# EasyEDA Pro project ProDoc_Schematic1_2024-07-10.epro

# Schematic Schematic1
Create Date: 2024-05-25; Page Name: P1; Project Name: C8T6_PWM; Schematic Name: Schematic1; Update Date: 2024-05-29; Company: 嘉立创EDA; Page Size: A4; Version: V1.0
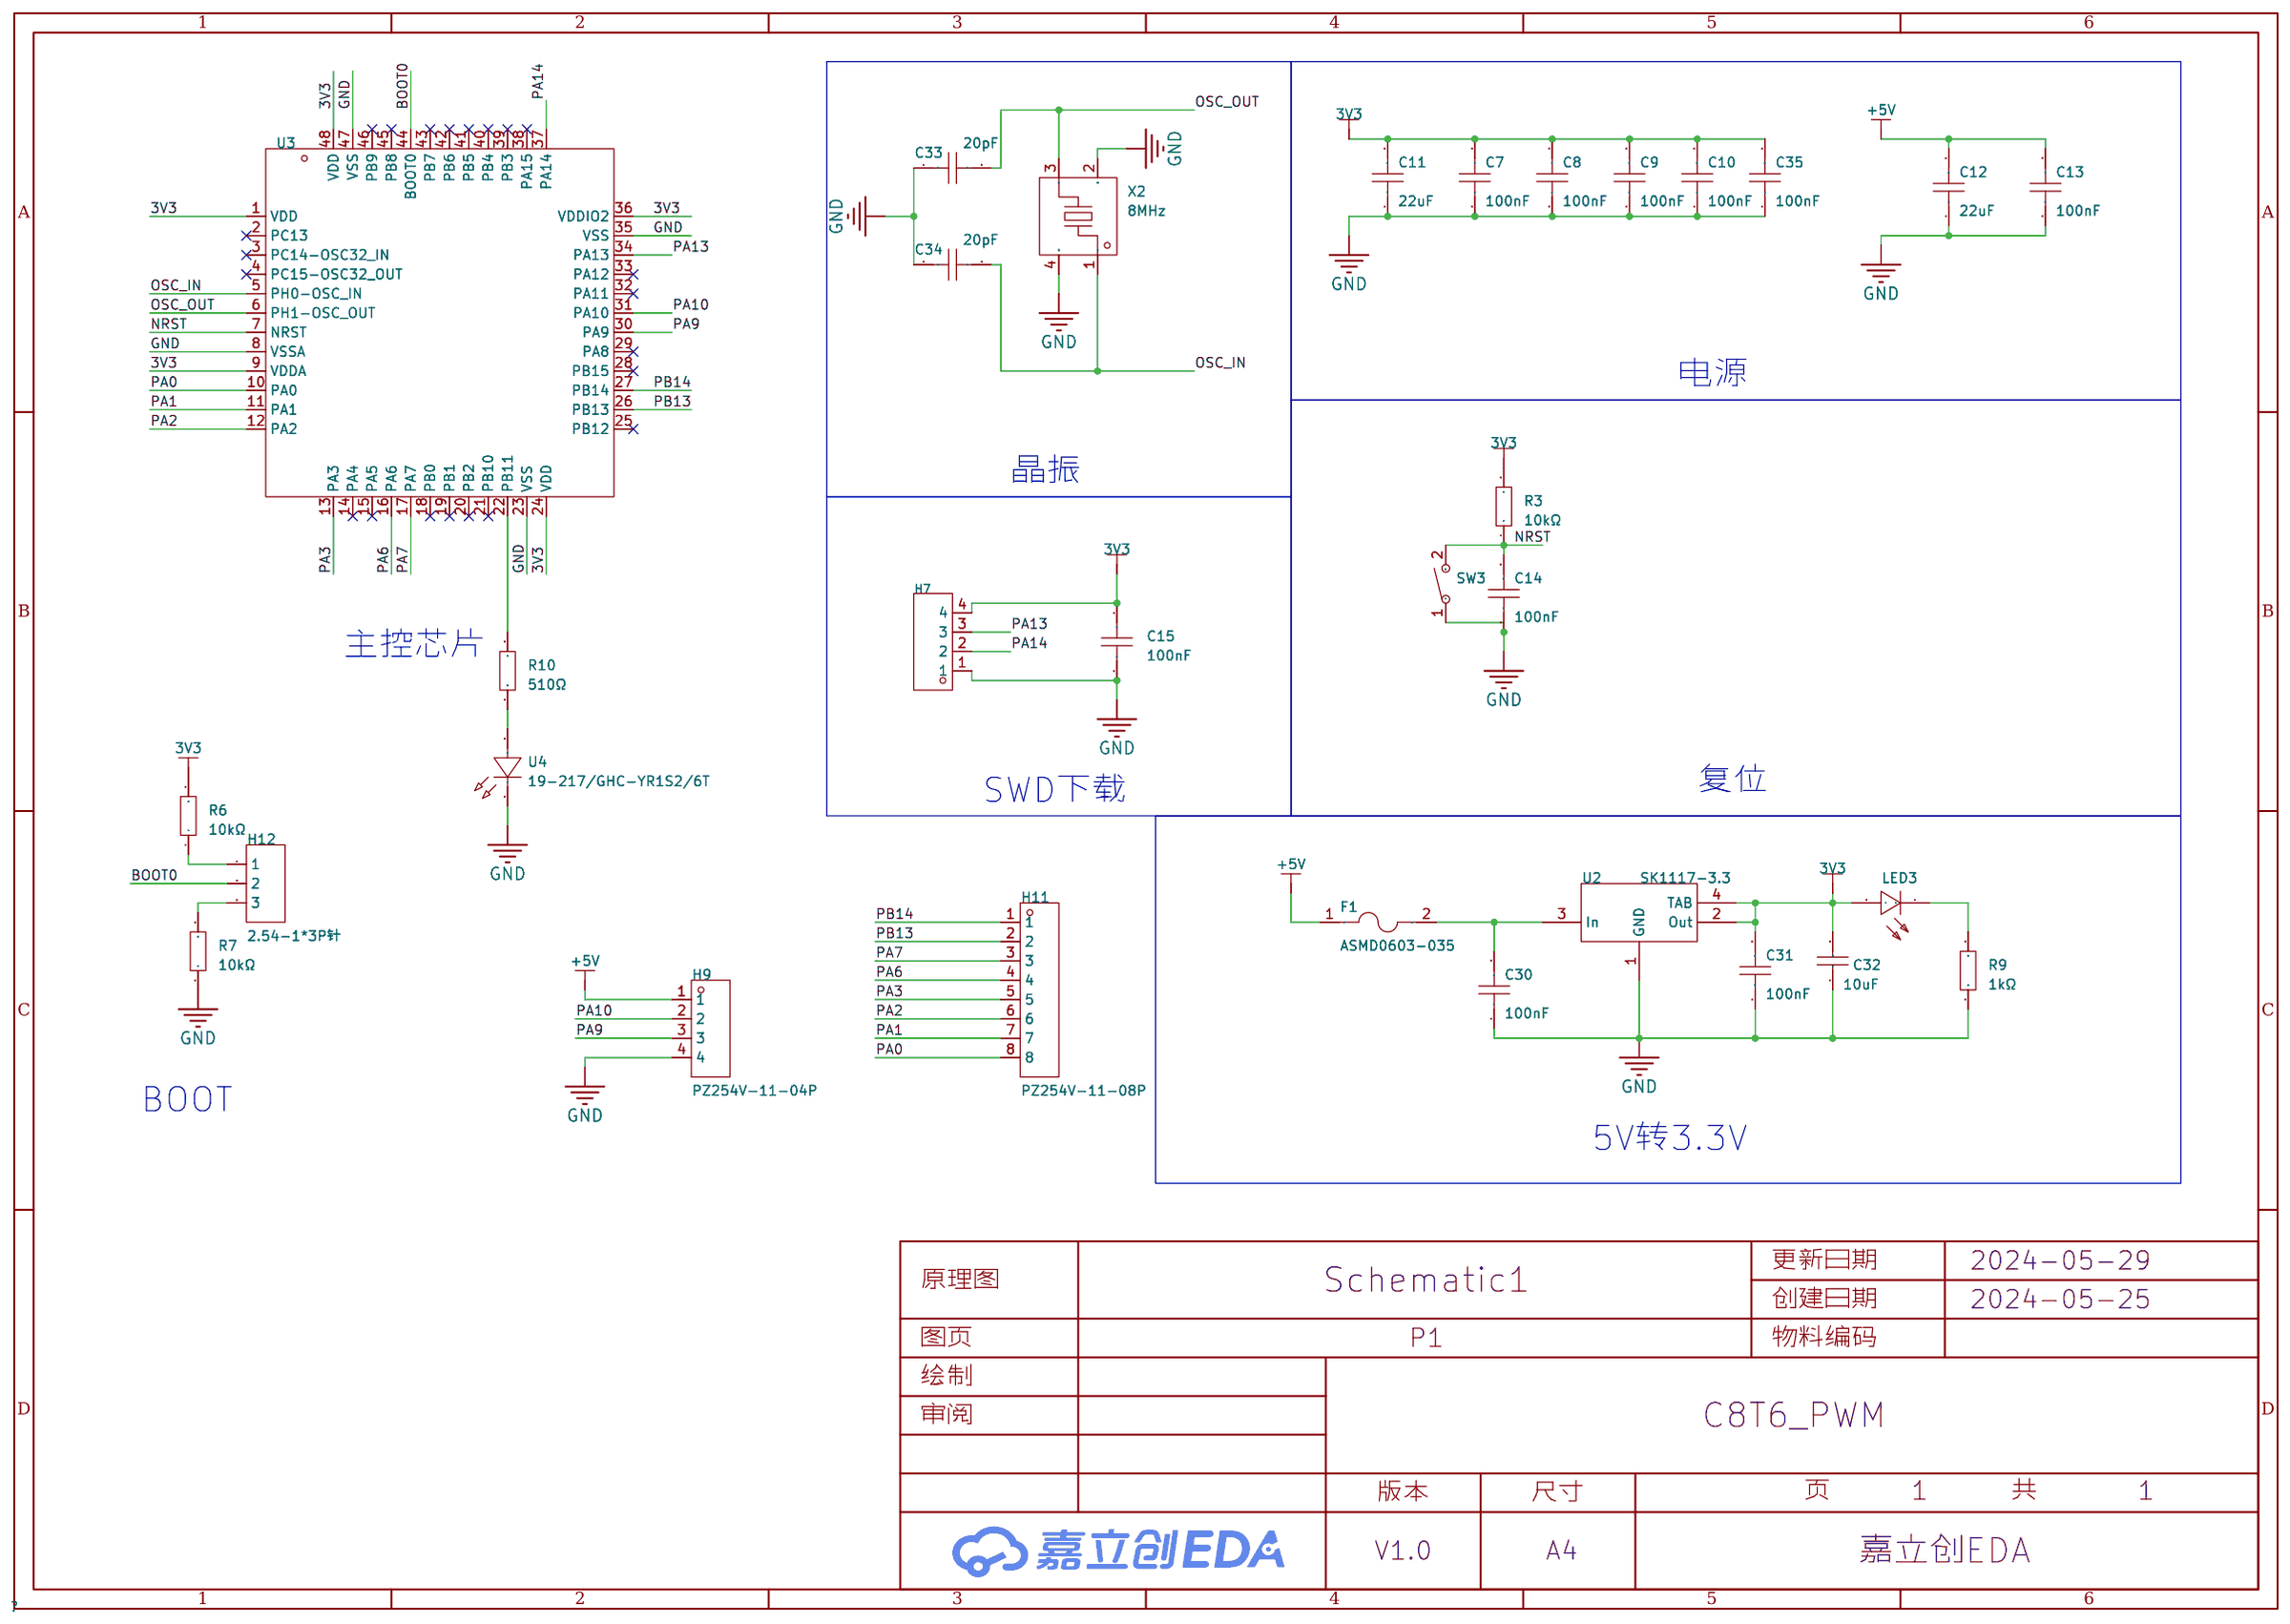
[diagram p0: schematic sheet]

## Parts
C7  100nF  [C0603]
C8  100nF  [C0603]
C9  100nF  [C0603]
C10  100nF  [C0603]
C11  22uF  [C0603]
C12  22uF  [C0603]
C13  100nF  [C0603]
C14  100nF  [C0603]
C15  100nF  [C0603]
C30  100nF  [C0603]
C31  100nF  [C0603]
C32  10uF  [C0805]
C33  20pF  [C0603]
C34  20pF  [C0603]
C35  100nF  [C0603]
F1  ASMD0603-035  [F0603]
H7  2.54-1*4P反弯排针  [HDR-TH_4P-P2.54-H-M-W10.4]
H9  PZ254V-11-04P  [HDR-TH_4P-P2.54-V-M]
H11  PZ254V-11-08P  [HDR-TH_8P-P2.54-V-M]
H12  2.54-1*3P针  [HDR-TH_3P-P2.54-V-M-1]
LED3  NCD0603R1  [LED0603-RD_RED]
R3  10kΩ  [R0805]
R6  10kΩ  [R0603]
R7  10kΩ  [R0603]
R9  1kΩ  [R0805]
R10  510Ω  [R0603]
SW3  UK-B0205G43-DP25Y  [KEY-TH_L6.0-W3.5-P6.50]
U2  SK1117-3.3  [SOT-223_L6.5-W3.5-P2.30-LS7.0-BR]
U3  STM32L051C8T6  [LQFP-48_L7.0-W7.0-P0.50-LS9.0-BL]
U4  19-217/GHC-YR1S2/6T  [LED0603-RD_GREEN]
X2  8MHz  [OSC-SMD_4P-L3.2-W2.5-BL]

## Library data of the parts
C7-C10 C13-C15 C30 C31 C35 = 0603F104Z500CT_C83060: 容值:100nF;精度:-20%~+80%;额定电压:50V;材质(温度系数):Y5V;; LCSC Part Name: 100nF -20%~+80% 50V; Supplier Part: C83060; Manufacturer: Walsin(华新科); Manufacturer Part: 0603F104Z500CT; Supplier Footprint: 0603; JLCPCB Part Class: 扩展库; Datasheet: https://atta.szlcsc.com/upload/public/pdf/source/20161119/1479540179445.pdf; Supplier: LCSC; Tolerance: -20%~+80%; Voltage Rated: 50V; Temperature Coefficient: Y5V
C11 C12 = CL10A226MR8NQNC: 容值:22uF;精度:±20%;额定电压:4V;材质(温度系数):X5R;; LCSC Part Name: 22uF ±20% 4V; Supplier Part: C478860; Manufacturer: SAMSUNG(三星); Supplier Footprint: 0603; JLCPCB Part Class: 扩展库; Datasheet: https://atta.szlcsc.com/upload/public/pdf/source/20200102/C478860_118E1D8359E9872D4918B647A961198D.pdf; Supplier: LCSC; Tolerance: ±20%; Voltage Rated: 4V; Temperature Coefficient: X5R
C32 = CL21A106KAYNNNE_C15850: 容值:10uF;精度:±10%;额定电压:25V;材质(温度系数):X5R;; LCSC Part Name: 10uF ±10% 25V; Supplier Part: C15850; Manufacturer: SAMSUNG(三星); Manufacturer Part: CL21A106KAYNNNE; Supplier Footprint: 0805; JLCPCB Part Class: Basic Part; Datasheet: https://atta.szlcsc.com/upload/public/pdf/source/20160103/1457707679302.pdf; Supplier: LCSC; Tolerance: ±10%; Voltage Rated: 25V; Temperature Coefficient: X5R
C33 C34 = 0603CG200J500NT: 容值:20pF;精度:±5%;额定电压:50V;材质(温度系数):C0G;; LCSC Part Name: 20pF ±5% 50V; Supplier Part: C91702; Manufacturer: FH(风华); Supplier Footprint: 0603; JLCPCB Part Class: 扩展库; Datasheet: https://atta.szlcsc.com/upload/public/pdf/source/20200305/C486355_26A10D38EF8C2A5C37091D0039909270.pdf; Supplier: LCSC; Tolerance: ±5%; Voltage Rated: 50V; Temperature Coefficient: C0G
F1 = ASMD0603-035: 最大电压:6V;最大电流:40A;保持电流:350mA;跳闸电流:750mA;; LCSC Part Name: 6V 350mA 0603自恢复; Supplier Part: C135322; Manufacturer: JDTfuse(集电通); Supplier Footprint: 0603; JLCPCB Part Class: 扩展库; Supplier: LCSC; Operating Voltage (Max): 6V; Current Rating (Max): 40A; Hold Current: 350mA; Trip Current: 750mA; Power Dissipation: 500mW; Resistance - Initial (Ri) (Min): 500mΩ; Resistance - Post Trip (R1) (Max): 3Ω; Maximum Time to Trip: 80ms; Operating Temperature: -40℃~+85℃
H7 = 2.54-1*4P反弯排针: 排数:单排;总PIN位数:4P;间距:2.54mm;插针结构:1x4P;行距:-;安装类型:弯插;圆针/方针:方针;额定电流:3A;额定电压:-;配合针长度:6mm;塑高:-;端接针长度:-;触头材质:-;触头镀层:-;工作温度范围:-55℃~+105℃;颜色:黑色;; LCSC Part Name: 2.54mm 1x4P 弯插 方针 托盘; Supplier Part: C91552; Manufacturer: BOOMELE(博穆精密); Supplier Footprint: 弯插,P=2.54mm; JLCPCB Part Class: 扩展库; Datasheet: https://atta.szlcsc.com/upload/public/pdf/source/20190508/C74252_03DDEC4696EE17172E44B96636392962.pdf; Supplier: LCSC; Number of Rows: 单排; Number of Pins: 4P; Pitch: 2.54mm; Pin Structure: 1x4P; Mounting Type: 弯插; Circluar Pins/Square Pins: 方针; Current Rating (Max): 3A; Length of Mating Pin: 6mm; Operating Temperature Range: -55℃~+105℃; Color: 黑色
H9 = PZ254V-11-04P: 插针结构:1x4P;间距:2.54mm;行距:-;圆针/方针:方针;安装类型:直插;排数:单排;总PIN位数:4P;额定电流:3A;额定电压:250V;配合针长度:6mm;塑高:2.5mm;端接针长度:3mm;触头材质:-;工作温度范围:-40℃~+105℃;颜色:黑色;; LCSC Part Name: 间距:2.54mm 1x4P 直插 方针; Supplier Part: C2691448; Manufacturer: XFCN(兴飞); Supplier Footprint: 插件,P=2.54mm; JLCPCB Part Class: 扩展库; Datasheet: https://atta.szlcsc.com/upload/public/pdf/source/20200309/C492403_F9F19131791D08044AD4F84F8E751A34.pdf; Supplier: LCSC; Pin Structure: 1x4P; Pitch: 2.54mm; Circluar Pins/Square Pins: 方针; Mounting Type: 直插; Number of Rows: 单排; Number of Pins: 4P; Current Rating (Max): 3A; Voltage Rating (Max): 250V; Length of Mating Pin: 6mm; Insulation Height: 2.5mm; Length of End Connection Pin: 3mm; Operating Temperature Range: -40℃~+105℃; Color: 黑色
H11 = PZ254V-11-08P: 插针结构:1x8P;间距:2.54mm;行距:-;圆针/方针:方针;安装类型:直插;排数:单排;总PIN位数:8P;额定电流:-;额定电压:-;配合针长度:6mm;塑高:2.5mm;端接针长度:3mm;触头材质:黄铜;触头镀层:-;工作温度范围:-40℃~+105℃;颜色:黑色;; LCSC Part Name: 间距:2.54mm 1x8P 直插 方针; Supplier Part: C492407; Manufacturer: XFCN(兴飞); Supplier Footprint: 插件,P=2.54mm; JLCPCB Part Class: 扩展库; Datasheet: https://atta.szlcsc.com/upload/public/pdf/source/20200309/C492407_83A6FB26A2233368EDB9516968EC6149.pdf; Supplier: LCSC; Pin Structure: 1x8P; Pitch: 2.54mm; Circluar Pins/Square Pins: 方针; Mounting Type: 直插; Number of Rows: 单排; Number of Pins: 8P; Length of Mating Pin: 6mm; Insulation Height: 2.5mm; Length of End Connection Pin: 3mm; Contact Material: 黄铜; Operating Temperature Range: -40℃~+105℃; Color: 黑色
H12 = 2.54-1*3P针: 插针结构:1x3P;间距:2.54mm;行距:-;圆针/方针:方针;安装类型:直插;排数:单排;总PIN位数:3P;额定电流:3A;额定电压:-;配合针长度:-;塑高:-;端接针长度:-;触头材质:-;触头镀层:-;工作温度范围:-40℃~+105℃;颜色:黑色;; LCSC Part Name: 间距:2.54mm 1x3P 直插 方针; Supplier Part: C49257; Manufacturer: BOOMELE(博穆精密); Supplier Footprint: 插件,P=2.54mm; JLCPCB Part Class: 扩展库; Datasheet: https://atta.szlcsc.com/upload/public/pdf/source/20221018/3E9408392E35E6F57A28985E5F7BF5C9.pdf; Supplier: LCSC; Pin Structure: 1x3P; Pitch: 2.54mm; Circluar Pins/Square Pins: 方针; Mounting Type: 直插; Number of Rows: 单排; Number of Pins: 3P; Current Rating (Max): 3A; Operating Temperature Range: -40℃~+105℃; Color: 黑色
LED3 = NCD0603R1_C84263: 发光颜色:红灯;; LCSC Part Name: 红灯; Supplier Part: C84263; Manufacturer: 国星光电; Supplier Footprint: 0603; JLCPCB Part Class: 扩展库; Datasheet: https://atta.szlcsc.com/upload/public/pdf/source/20200820/C84263_DABC6A75E58F576973B407FDBA283D60.pdf; Supplier: LCSC; Emitted Color: 红灯
R3 = 0805W8F1002T5E_C17414: 电阻类型:厚膜电阻;阻值:10kΩ;精度:±1%;功率:125mW;; LCSC Part Name: 10kΩ ±1% 125mW; Supplier Part: C17414; Manufacturer: UNI-ROYAL(厚声); Manufacturer Part: 0805W8F1002T5E; Supplier Footprint: 0805; JLCPCB Part Class: 基础库; Datasheet: https://atta.szlcsc.com/upload/public/pdf/source/20200306/C422600_1E6D84923E4A46A82E41ADD87F860B5C.pdf; Supplier: LCSC; Type: 厚膜电阻; Tolerance: ±1%; Power(Watts): 125mW; Temperature Coefficient: ±100ppm/℃; Overload Voltage (Max): 150V; Operating Temperature Range: -55℃~+155℃
R6 R7 = 0603WAF1002T5E: 电阻类型:厚膜电阻;阻值:10kΩ;精度:±1%;功率:100mW;最大工作电压:75V;温度系数:±100ppm/℃;; LCSC Part Name: 厚膜电阻 10kΩ ±1% 100mW; Supplier Part: C25804; Manufacturer: UNI-ROYAL(厚声); Supplier Footprint: 0603; JLCPCB Part Class: 基础库; Datasheet: https://atta.szlcsc.com/upload/public/pdf/source/20200306/C422600_1E6D84923E4A46A82E41ADD87F860B5C.pdf; Supplier: LCSC; Type: 厚膜电阻; Tolerance: ±1%; Power(Watts): 100mW; Overload Voltage (Max): 75V; Temperature Coefficient: ±100ppm/℃; Operating Temperature Range: -55℃~+155℃
R9 = 0805W8F1001T5E: 电阻类型:厚膜电阻;阻值:1kΩ;精度:±1%;功率:125mW;; LCSC Part Name: 1kΩ ±1% 125mW; Supplier Part: C17513; Manufacturer: UNI-ROYAL(厚声); Supplier Footprint: 0805; JLCPCB Part Class: Basic Part; Datasheet: https://atta.szlcsc.com/upload/public/pdf/source/20200306/C422600_1E6D84923E4A46A82E41ADD87F860B5C.pdf; Supplier: LCSC; Type: 厚膜电阻; Tolerance: ±1%; Power(Watts): 125mW; Temperature Coefficient: ±100ppm/℃; Overload Voltage (Max): 150V; Operating Temperature Range: -55℃~+155℃
R10 = 0603WAF5100T5E: 电阻类型:厚膜电阻;阻值:510Ω;精度:±1%;功率:100mW;最大工作电压:75V;温度系数:±100ppm/℃;; LCSC Part Name: 510Ω ±1% 100mW 厚膜电阻; Supplier Part: C23193; Manufacturer: UNI-ROYAL(厚声); Supplier Footprint: 0603; JLCPCB Part Class: 基础库; Datasheet: https://atta.szlcsc.com/upload/public/pdf/source/20200306/C422600_1E6D84923E4A46A82E41ADD87F860B5C.pdf; Supplier: LCSC; Type: 厚膜电阻; Tolerance: ±1%; Power(Watts): 100mW; Overload Voltage (Max): 75V; Temperature Coefficient: ±100ppm/℃; Operating Temperature Range: -55℃~+155℃
SW3 = UK-B0205G43-DP25Y: 触点电流:50mA;额定电压(DC):12V;绝缘电阻:100MΩ;电路结构:单刀单掷;安装方式:直插;带灯:无;作用力:250gf@±30gf;机械寿命:10万次;带支架:否;; LCSC Part Name: 3*6*4.3mm 直插 轻触开关; Supplier Part: C493223; Manufacturer: USAKRO(美韩); Supplier Footprint: 插件; JLCPCB Part Class: 扩展库; Datasheet: https://atta.szlcsc.com/upload/public/pdf/source/20200316/C493223_1DC686A4C6862A7DC75CD4D66066BAFD.pdf; Supplier: LCSC; Contact Current: 50mA; Voltage Rating (DC): 12V; Insulation Resistance: 100MΩ; Circuit: 单刀单掷; Mounting Style: 直插; Actuator Style: 矩形按钮; Actuator/Cap Color: 白色; With Lamp: 无; Operating Force: 250gf@±30gf; Mechanical Life: 10万次; Operating Temperature: -20℃~+70℃; Pin Style: PC引脚; Switch Length: 3mm; Switch Width: 6mm; Switch Height: 4.3mm; Strike Gundam: 否
U2 = SK1117-3.3: 输出类型:固定;输出极性:正;最大输入电压:18V;输出电压:3.3V;输出电流:-;电源纹波抑制比(PSRR):70dB@(120Hz);; Supplier Part: C165482; Manufacturer: SHIKUES(时科); Supplier Footprint: SOT-223; JLCPCB Part Class: 扩展库; Datasheet: https://atta.szlcsc.com/upload/public/pdf/source/20190505/C165482_82C1AFFA508C9159D3B5A1FBC2B4A936.pdf; Supplier: LCSC; Output Type: 固定; Output Polarity: 正; Number of Outputs: 1; Maximum Input Voltage: 18V; Output Voltage: 3.3V; Dropout Voltage: 1.4V@1A; Power Supply Rejection Ratio (PSRR): 70dB@(120Hz); Feature: 过热保护,过流保护; Operating Temperature: 0℃~+150℃@(Tj)
U3 = STM32L051C8T6: CPU内核:ARM-M系列;程序存储容量:64KB;RAM总容量:8KB;GPIO端口数量:37;工作电压范围:1.65V~3.6V;CPU最大主频:32MHz;程序存储器类型:FLASH;; Supplier Part: C110878; Manufacturer: ST(意法半导体); Supplier Footprint: LQFP-48(7x7); JLCPCB Part Class: 扩展库; Datasheet: https://atta.szlcsc.com/upload/public/pdf/source/20170810/C124724_1502335304342879861.pdf; Supplier: LCSC; CPU Core: ARM-M系列; Program Storage Size: 64KB; RAM Size: 8KB; GPIO Ports Number: 37; Operating Voltage Range: 1.65V~3.6V; CPU Maximum Speed: 32MHz; Program Memory Type: FLASH; Operating Temperature Range: -40℃~+85℃; ADC (Bit): 12bit; Peripheral/Function: DMA；PWM; Watchdog: 有; Infrared Data Association: 有; Low-Voltage Detect: 有; Direct Memory Access: 有; Internal Oscillator: 有
U4 = 19-217/GHC-YR1S2/6T: LCSC Part Name: 翠绿; Supplier Part: C2986059; Manufacturer: EVERLIGHT(亿光); Supplier Footprint: 0603; JLCPCB Part Class: 扩展库; Datasheet: https://atta.szlcsc.com/upload/public/pdf/source/20220705/5270194960AA522E2931401D212035CB.pdf; Supplier: LCSC
X2 = X32258MOB4SI: 晶振类型:贴片晶振;频率:8MHz;常温频差:±10ppm;外接负载电容:12pF;频率稳定度(全温):±20ppm;; LCSC Part Name: 8MHz ±10ppm 12pF; Supplier Part: C2682775; Manufacturer: YXC(扬兴晶振); Supplier Footprint: SMD3225-4P; JLCPCB Part Class: 扩展库; Datasheet: https://atta.szlcsc.com/upload/public/pdf/source/20240329/19D5F850207469550BEB00D7DFEDBC7A.pdf; Supplier: LCSC; Crystal Type: 贴片晶振; Normal temperature Frequency Tolerance: ±10ppm; External load capacitor: 12pF; Frequency Stability(Full temperature range): ±20ppm; Equivalent Series Resistance (ESR): 150Ω; Operating Temperature: -40℃~+85℃

## Nets
3V3: C7.2 C8.2 C9.2 C10.2 C11.2 C15.1 C31.2 C32.2 C35.2 H7.4 LED3.2(A) R3.2 R6.2 U2.2(Out) U2.4(TAB) U3.1(VDD) U3.9(VDDA) U3.24(VDD) U3.36(VDDIO2) U3.48(VDD)
+5V: C12.2 C13.2 F1.1 H9.1
GND: C7.1 C8.1 C9.1 C10.1 C11.1 C12.1 C13.1 C14.1 C15.2 C30.1 C31.1 C32.1 C33.1 C34.1 C35.1 H7.1 H9.4 R7.1 R9.1 SW3.1 U2.1(GND) U3.8(VSSA) U3.23(VSS) U3.35(VSS) U3.47(VSS) U4.1(K) X2.2(GND) X2.4(GND)
BOOT0: H12.2 U3.44(BOOT0)
NRST: C14.2 R3.1 SW3.2 U3.7(NRST)
OSC_IN: C34.2 U3.5(PH0-OSC_IN) X2.1
OSC_OUT: C33.2 U3.6(PH1-OSC_OUT) X2.3
PA0: H11.8 U3.10(PA0)
PA1: H11.7 U3.11(PA1)
PA2: H11.6 U3.12(PA2)
PA3: H11.5 U3.13(PA3)
PA6: H11.4 U3.16(PA6)
PA7: H11.3 U3.17(PA7)
PA9: H9.3 U3.30(PA9)
PA10: H9.2 U3.31(PA10)
PA13: H7.3 U3.34(PA13)
PA14: H7.2 U3.37(PA14)
PB13: H11.2 U3.26(PB13)
PB14: H11.1 U3.27(PB14)
Net-(C30-2): C30.2 F1.2 U2.3(In)
Net-(H12-1): H12.1 R6.1
Net-(H12-3): H12.3 R7.2
Net-(LED3-1): LED3.1(K) R9.2
Net-(R10-1): R10.1 U4.2(A)
Net-(R10-2): R10.2 U3.22(PB11)

Not connected (* = marked no-connect by the designer): U3 2(PC13)* 3(PC14-OSC32_IN)* 4(PC15-OSC32_OUT)* 14(PA4)* 15(PA5)* 18(PB0)* 19(PB1)* 20(PB2)* 21(PB10)* 25(PB12)* 28(PB15)* 29(PA8)* 32(PA11)* 33(PA12)* 38(PA15)* 39(PB3)* 40(PB4)* 41(PB5)* 42(PB6)* 43(PB7)* 45(PB8)* 46(PB9)*

## Notes on the sheet
- 电源
- 晶振
- 主控芯片
- 复位
- SWD下载
- BOOT
- 5V转3.3V
